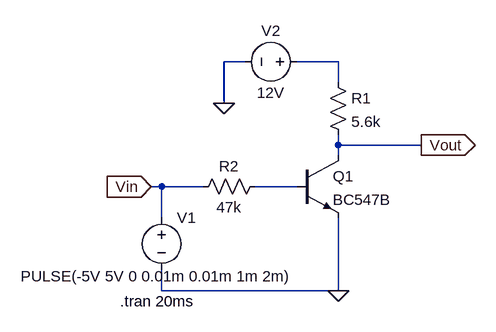
[diagram p0: schematic normallyOFswitch.asc]
normallyOFswitch.asc, the LTspice schematic file:
Version 4
SHEET 1 880 680
WIRE 112 -48 80 -48
WIRE 256 -48 192 -48
WIRE 256 -16 256 -48
WIRE 80 16 80 -48
WIRE 256 80 256 64
WIRE 384 80 256 80
WIRE 256 96 256 80
WIRE -16 144 -32 144
WIRE 48 144 -16 144
WIRE 192 144 128 144
WIRE -16 192 -16 144
WIRE -16 304 -16 272
WIRE 256 304 256 192
WIRE 256 304 -16 304
FLAG 256 304 0
FLAG 384 80 Vout
IOPIN 384 80 Out
FLAG -32 144 Vin
IOPIN -32 144 In
FLAG 80 16 0
SYMBOL npn 192 96 R0
SYMATTR InstName Q1
SYMATTR Value BC547B
SYMBOL res 240 -32 R0
SYMATTR InstName R1
SYMATTR Value 5.6k
SYMBOL res 144 128 R90
WINDOW 0 0 56 VBottom 2
WINDOW 3 32 56 VTop 2
SYMATTR InstName R2
SYMATTR Value 47k
SYMBOL voltage -16 176 R0
WINDOW 3 -217 106 Left 2
WINDOW 123 0 0 Left 0
WINDOW 39 0 0 Left 0
SYMATTR Value PULSE(-5V 5V 0 0.01m 0.01m 1m 2m)
SYMATTR InstName V1
SYMBOL voltage 208 -48 R90
WINDOW 0 -32 56 VBottom 2
WINDOW 3 32 56 VTop 2
SYMATTR InstName V2
SYMATTR Value 12V
TEXT -80 320 Left 2 !.tran 20ms

The netlist it stands for:
* normallyOFswitch.asc
Q1 Vout N002 0 0 BC547B
R1 N001 Vout 5.6k
R2 N002 Vin 47k
V1 Vin 0 PULSE(-5V 5V 0 0.01m 0.01m 1m 2m)
V2 N001 0 12V
.model NPN NPN
.model PNP PNP
.lib standard.bjt
.tran 20ms
.backanno
.end